# EAGLE design TLNS_driver_board (EAGLE 7.3.0)
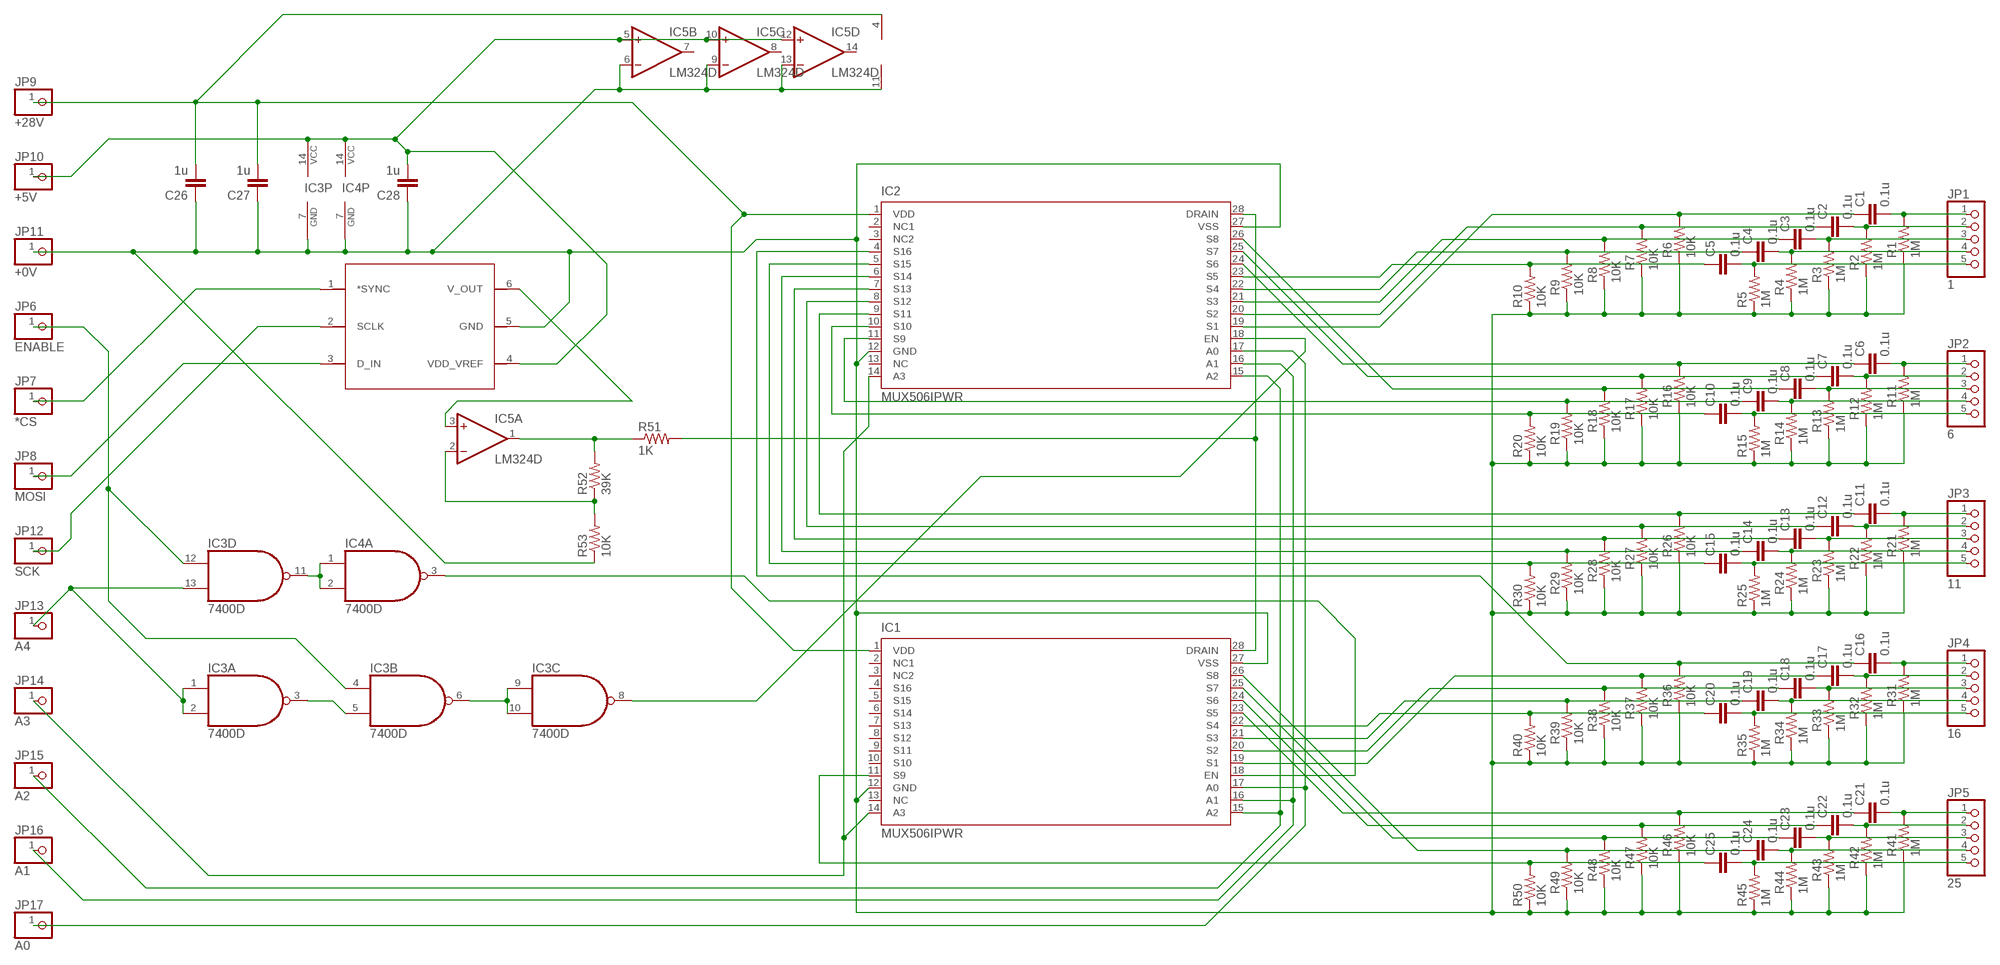
[diagram p0: schematic, sheet 1]

## Parts
C1  0.1u  C-EUC0603K  [C0603K]
C2  0.1u  C-EUC0603K  [C0603K]
C3  0.1u  C-EUC0603K  [C0603K]
C4  0.1u  C-EUC0603K  [C0603K]
C5  0.1u  C-EUC0603K  [C0603K]
C6  0.1u  C-EUC0603K  [C0603K]
C7  0.1u  C-EUC0603K  [C0603K]
C8  0.1u  C-EUC0603K  [C0603K]
C9  0.1u  C-EUC0603K  [C0603K]
C10  0.1u  C-EUC0603K  [C0603K]
C11  0.1u  C-EUC0603K  [C0603K]
C12  0.1u  C-EUC0603K  [C0603K]
C13  0.1u  C-EUC0603K  [C0603K]
C14  0.1u  C-EUC0603K  [C0603K]
C15  0.1u  C-EUC0603K  [C0603K]
C16  0.1u  C-EUC0603K  [C0603K]
C17  0.1u  C-EUC0603K  [C0603K]
C18  0.1u  C-EUC0603K  [C0603K]
C19  0.1u  C-EUC0603K  [C0603K]
C20  0.1u  C-EUC0603K  [C0603K]
C21  0.1u  C-EUC0603K  [C0603K]
C22  0.1u  C-EUC0603K  [C0603K]
C23  0.1u  C-EUC0603K  [C0603K]
C24  0.1u  C-EUC0603K  [C0603K]
C25  0.1u  C-EUC0603K  [C0603K]
C26  1u  C-EUC0603K  [C0603K]
C27  1u  C-EUC0603K  [C0603K]
C28  1u  C-EUC0603K  [C0603K]
IC1  MUX506IPWR  MUX506IPWR550W  [SO28W]
IC2  MUX506IPWR  MUX506IPWR550W  [SO28W]
IC3  7400D  [SO14]
IC4  7400D  [SO14]
IC5  LM324D  [SO14]
JP1  1  PINHD-1X5  [1X05]
JP2  6  PINHD-1X5  [1X05]
JP3  11  PINHD-1X5  [1X05]
JP4  16  PINHD-1X5  [1X05]
JP5  25  PINHD-1X5  [1X05]
JP6  ENABLE  PINHD-1X1  [1X01]
JP7  *CS  PINHD-1X1  [1X01]
JP8  MOSI  PINHD-1X1  [1X01]
JP9  +28V  PINHD-1X1  [1X01]
JP10  +5V  PINHD-1X1  [1X01]
JP11  +0V  PINHD-1X1  [1X01]
JP12  SCK  PINHD-1X1  [1X01]
JP13  A4  PINHD-1X1  [1X01]
JP14  A3  PINHD-1X1  [1X01]
JP15  A2  PINHD-1X1  [1X01]
JP16  A1  PINHD-1X1  [1X01]
JP17  A0  PINHD-1X1  [1X01]
R1  1M  R-US_R0603  [R0603]
R2  1M  R-US_R0603  [R0603]
R3  1M  R-US_R0603  [R0603]
R4  1M  R-US_R0603  [R0603]
R5  1M  R-US_R0603  [R0603]
R6  10K  R-US_R0603  [R0603]
R7  10K  R-US_R0603  [R0603]
R8  10K  R-US_R0603  [R0603]
R9  10K  R-US_R0603  [R0603]
R10  10K  R-US_R0603  [R0603]
R11  1M  R-US_R0603  [R0603]
R12  1M  R-US_R0603  [R0603]
R13  1M  R-US_R0603  [R0603]
R14  1M  R-US_R0603  [R0603]
R15  1M  R-US_R0603  [R0603]
R16  10K  R-US_R0603  [R0603]
R17  10K  R-US_R0603  [R0603]
R18  10K  R-US_R0603  [R0603]
R19  10K  R-US_R0603  [R0603]
R20  10K  R-US_R0603  [R0603]
R21  1M  R-US_R0603  [R0603]
R22  1M  R-US_R0603  [R0603]
R23  1M  R-US_R0603  [R0603]
R24  1M  R-US_R0603  [R0603]
R25  1M  R-US_R0603  [R0603]
R26  10K  R-US_R0603  [R0603]
R27  10K  R-US_R0603  [R0603]
R28  10K  R-US_R0603  [R0603]
R29  10K  R-US_R0603  [R0603]
R30  10K  R-US_R0603  [R0603]
R31  1M  R-US_R0603  [R0603]
R32  1M  R-US_R0603  [R0603]
R33  1M  R-US_R0603  [R0603]
R34  1M  R-US_R0603  [R0603]
R35  1M  R-US_R0603  [R0603]
R36  10K  R-US_R0603  [R0603]
R37  10K  R-US_R0603  [R0603]
R38  10K  R-US_R0603  [R0603]
R39  10K  R-US_R0603  [R0603]
R40  10K  R-US_R0603  [R0603]
R41  1M  R-US_R0603  [R0603]
R42  1M  R-US_R0603  [R0603]
R43  1M  R-US_R0603  [R0603]
R44  1M  R-US_R0603  [R0603]
R45  1M  R-US_R0603  [R0603]
R46  10K  R-US_R0603  [R0603]
R47  10K  R-US_R0603  [R0603]
R48  10K  R-US_R0603  [R0603]
R49  10K  R-US_R0603  [R0603]
R50  10K  R-US_R0603  [R0603]
R51  1K  R-US_R1206  [R1206]
R52  39K  R-US_R0603  [R0603]
R53  10K  R-US_R0603  [R0603]
U$1  DAC7311  [SC70-6]

## Nets
N$1: C1.2 JP1.1 R1.2
N$2: C2.2 JP1.2 R2.2
N$3: C3.2 JP1.3 R3.2
N$4: C4.2 JP1.4 R4.2
N$5: C5.2 JP1.5 R5.2
N$6: C26.1 C27.1 C28.1 IC1.12(GND) IC1.27(VSS) IC2.12(GND) IC2.27(VSS) IC3.7(P:GND) IC4.7(P:GND) IC5.6(B:-IN) IC5.9(C:-IN) IC5.11(P:V-) IC5.13(D:-IN) JP11.1 R1.1 R2.1 R3.1 R4.1 R5.1 R6.1 R7.1 R8.1 R9.1 R10.1 R11.1 R12.1 R13.1 R14.1 R15.1 R16.1 R17.1 R18.1 R19.1 R20.1 R21.1 R22.1 R23.1 R24.1 R25.1 R26.1 R27.1 R28.1 R29.1 R30.1 R31.1 R32.1 R33.1 R34.1 R35.1 R36.1 R37.1 R38.1 R39.1 R40.1 R41.1 R42.1 R43.1 R44.1 R45.1 R46.1 R47.1 R48.1 R49.1 R50.1 R53.1 U$1.5(GND)
N$7: C4.1 IC2.22(S4) R9.2
N$8: C3.1 IC2.21(S3) R8.2
N$9: C2.1 IC2.20(S2) R7.2
N$10: C1.1 IC2.19(S1) R6.2
N$11: C5.1 IC2.23(S5) R10.2
N$12: C6.2 JP2.1 R11.2
N$13: C7.2 JP2.2 R12.2
N$14: C8.2 JP2.3 R13.2
N$15: C9.2 JP2.4 R14.2
N$16: C10.2 JP2.5 R15.2
N$17: C9.1 IC2.11(S9) R19.2
N$18: C8.1 IC2.26(S8) R18.2
N$19: C7.1 IC2.25(S7) R17.2
N$20: C6.1 IC2.24(S6) R16.2
N$21: IC1.28(DRAIN) IC2.28(DRAIN) R51.2
N$22: C10.1 IC2.10(S10) R20.2
N$23: C11.2 JP3.1 R21.2
N$24: C12.2 JP3.2 R22.2
N$25: C13.2 JP3.3 R23.2
N$26: C14.2 JP3.4 R24.2
N$27: C15.2 JP3.5 R25.2
N$28: C14.1 IC2.6(S14) R29.2
N$29: C13.1 IC2.7(S13) R28.2
N$30: C12.1 IC2.8(S12) R27.2
N$31: C11.1 IC2.9(S11) R26.2
N$32: IC3.11(D:O) IC4.1(A:I0) IC4.2(A:I1)
N$33: C15.1 IC2.5(S15) R30.2
N$34: C16.2 JP4.1 R31.2
N$35: C17.2 JP4.2 R32.2
N$36: C18.2 JP4.3 R33.2
N$37: C19.2 JP4.4 R34.2
N$38: C20.2 JP4.5 R35.2
N$39: C19.1 IC1.21(S3) R39.2
N$40: C18.1 IC1.20(S2) R38.2
N$41: C17.1 IC1.19(S1) R37.2
N$42: C16.1 IC2.4(S16) R36.2
N$43: IC1.18(EN) IC4.3(A:O)
N$44: C20.1 IC1.22(S4) R40.2
N$45: C21.2 JP5.1 R41.2
N$46: C22.2 JP5.2 R42.2
N$47: C23.2 JP5.3 R43.2
N$48: C24.2 JP5.4 R44.2
N$49: C25.2 JP5.5 R45.2
N$50: C24.1 IC1.26(S8) R49.2
N$51: C23.1 IC1.25(S7) R48.2
N$52: C22.1 IC1.24(S6) R47.2
N$53: C21.1 IC1.23(S5) R46.2
N$54: C26.2 C27.2 IC1.1(VDD) IC2.1(VDD) IC5.4(P:V+) JP9.1
N$55: C25.1 IC1.11(S9) R50.2
N$56: IC1.17(A0) IC2.17(A0) JP17.1
N$57: IC1.16(A1) IC2.16(A1) JP16.1
N$58: IC1.15(A2) IC2.15(A2) JP15.1
N$59: IC1.14(A3) IC2.14(A3) JP14.1
N$60: IC3.1(A:I0) IC3.2(A:I1) IC3.13(D:I1) JP13.1
N$61: IC3.4(B:I0) IC3.12(D:I0) JP6.1
N$62: C28.2 IC3.14(P:VCC) IC4.14(P:VCC) IC5.5(B:+IN) IC5.10(C:+IN) IC5.12(D:+IN) JP10.1 U$1.4(VDD_VREF)
N$63: IC3.3(A:O) IC3.5(B:I1)
N$64: IC3.6(B:O) IC3.9(C:I0) IC3.10(C:I1)
N$65: IC2.18(EN) IC3.8(C:O)
N$66: IC5.1(A:OUT) R51.1 R52.2
N$67: IC5.2(A:-IN) R52.1 R53.2
N$68: JP8.1 U$1.3(D_IN)
N$69: JP12.1 U$1.2(SCLK)
N$72: JP7.1 U$1.1(*SYNC)
N$73: IC5.3(A:+IN) U$1.6(V_OUT)
Unconnected: IC1.2(NC1) IC1.3(NC2) IC1.4(S16) IC1.5(S15) IC1.6(S14) IC1.7(S13) IC1.9(S11) IC1.10(S10) IC1.13(NC) IC2.2(NC1) IC2.3(NC2) IC2.13(NC) IC4.4(B:I0) IC4.5(B:I1) IC4.6(B:O) IC4.8(C:O) IC4.9(C:I0) IC4.10(C:I1) IC4.11(D:O) IC4.12(D:I0) IC4.13(D:I1) IC5.7(B:OUT) IC5.8(C:OUT) IC5.14(D:OUT)

## Power pins joined to a net without a drawn wire
S12: IC1.8(S12)

## Library data of the parts
C1-C28 = rcl:C-EU: CAPACITOR, European symbol
IC1 IC2 = microchip:MUX506IPWR: USB Microcontrollers with nanoWatt Technology High-Performance, Enhanced Flash, 28/40/44-Pin, Source: http://ww1.microchip.com/downloads/en/devicedoc/39632c.pdf; MF: MICROCHIP; MPN: PIC18F2550-I/SO; OC_FARNELL: 9321268; OC_NEWARK: 73K1297
IC3 IC4 = 74xx-us:74*00: Quad 2-input NAND gate
IC5 = linear:LM324: OP AMP
JP1-JP5 = pinhead:PINHD-1X5: PIN HEADER
JP6-JP17 = pinhead:PINHD-1X1: PIN HEADER
R1-R53 = rcl:R-US_: RESISTOR, American symbol
U$1 = precision_tACS:DAC7311: 12-bit DAC7311

## Board
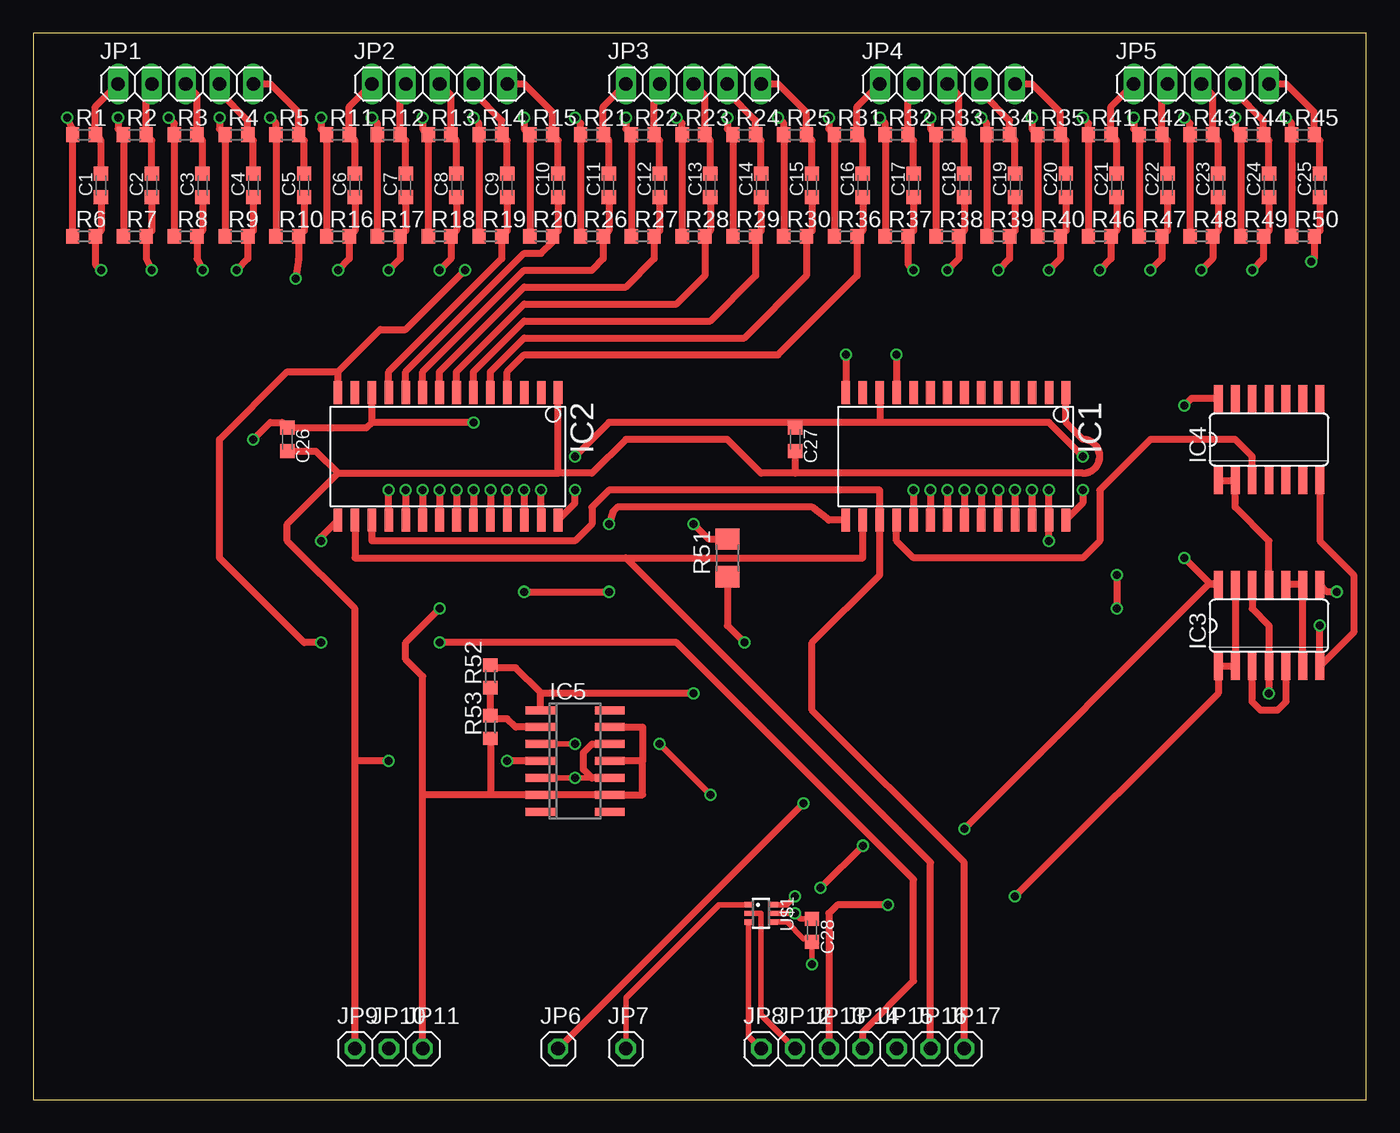
[diagram p1: board, top side]
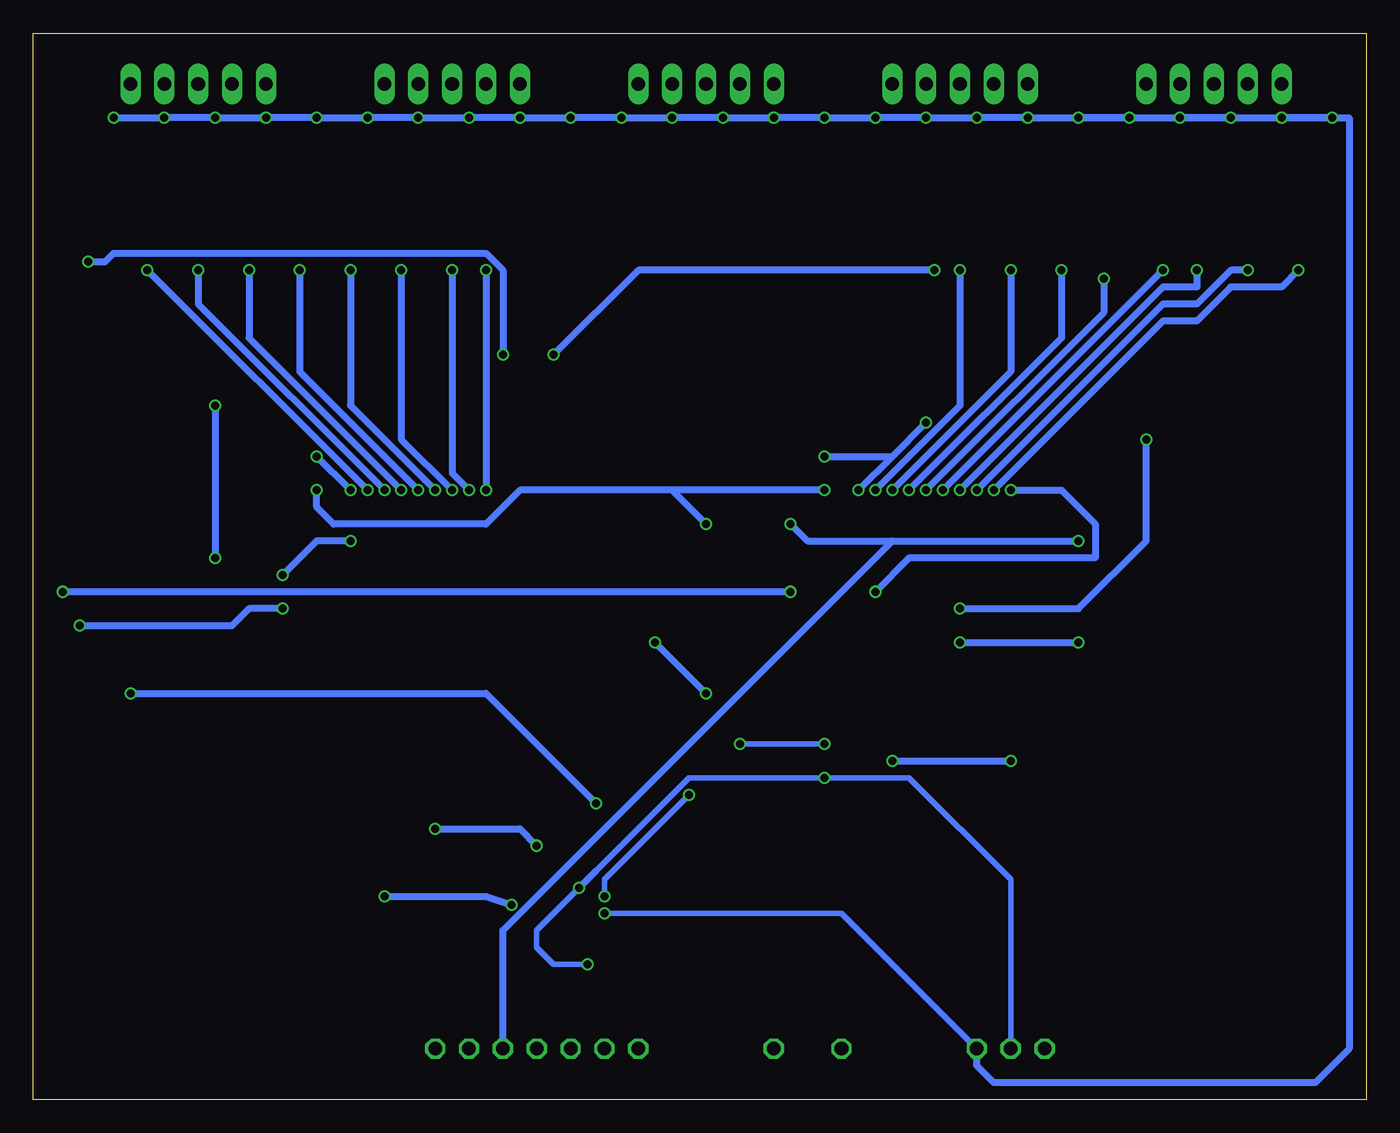
[diagram p2: board, bottom side, seen from below]

Size 100 x 80 mm. Coordinates in mm from the lower left corner, seen from the top.
Outline: 0,0 100,0 100,80 0,80 0,0
Copper layers (1*16): Top 0.035mm / dielectric 1.5mm / Bottom 0.035mm
Design rules "SeeedStudio_2layer_DRU_no_angle_20140221": minimum track width 6mil, minimum drill 12mil, track to track 6mil, track to pad 6mil, pad to pad 6mil, via to via 6mil, smd to smd 0mil, copper to edge 10mil, drill to drill 10mil, minimum pad ring 10mil, minimum via ring 6mil, stop-mask expansion 2mil, vias tented up to drill 100mil, thermal gap 10mil

### Footprints (pad centres in the part's own frame; a part is rotated, then mirrored left to right if it is on the bottom)
C0603K = smd 1.05 x 1.08: 1 -0.875,0; 2 0.875,0
SO28W = smd 0.65 x 1.7: 1 -7.62,-4.78; 2 -6.35,-4.78; 3 -5.08,-4.78; 4 -3.81,-4.78; 5 -2.54,-4.78; 6 -1.27,-4.78; 7 0,-4.78; 8 1.27,-4.78; 9 2.54,-4.78; 10 3.81,-4.78; 11 5.08,-4.78; 12 6.35,-4.78; 13 7.62,-4.78; 14 8.89,-4.78; 15 8.89,4.78; 16 7.62,4.78; 17 6.35,4.78; 18 5.08,4.78; 19 3.81,4.78; 20 2.54,4.78; 21 1.27,4.78; 22 0,4.78; 23 -1.27,4.78; 24 -2.54,4.78; 25 -3.81,4.78; 26 -5.08,4.78; 27 -6.35,4.78; 28 -7.62,4.78
SO14 = smd 0.66 x 2.032: 1 -3.81,-3.073; 2 -2.54,-3.073; 3 -1.27,-3.073; 4 0,-3.073; 5 1.27,-3.073; 6 2.54,-3.073; 7 3.81,-3.073; 8 3.81,3.073; 9 2.54,3.073; 10 1.27,3.073; 11 0,3.073; 12 -1.27,3.073; 13 -2.54,3.073; 14 -3.81,3.073
SO14' = smd 0.6 x 2.2: 1 -3.81,-2.6; 2 -2.54,-2.6; 3 -1.27,-2.6; 4 0,-2.6; 5 1.27,-2.6; 6 2.54,-2.6; 7 3.81,-2.6; 8 3.81,2.6; 9 2.54,2.6; 10 1.27,2.6; 11 0,2.6; 12 -1.27,2.6; 13 -2.54,2.6; 14 -3.81,2.6
1X05 = drill 1.016 long: 1 -5.08,0; 2 -2.54,0; 3 0,0; 4 2.54,0; 5 5.08,0
1X01 = drill 1.016 octagon: 1 0,0
R0603 = smd 1 x 1.1: 1 -0.85,0; 2 0.85,0
R1206 = smd 1.6 x 1.803: 1 -1.422,0; 2 1.422,0
SC70-6 = smd 0.4 x 0.6: 1 -0.65,-0.95; 2 0,-0.95; 3 0.65,-0.95; 4 0.65,0.95; 5 0,0.95; 6 -0.65,0.95

### Placement (x,y rotation side)
C1  5.08,68.58 90 top
C2  8.89,68.58 90 top
C3  12.7,68.58 90 top
C4  16.51,68.58 90 top
C5  20.32,68.58 90 top
C6  24.13,68.58 90 top
C7  27.94,68.58 90 top
C8  31.75,68.58 90 top
C9  35.56,68.58 90 top
C10  39.37,68.58 90 top
C11  43.18,68.58 90 top
C12  46.99,68.58 90 top
C13  50.8,68.58 90 top
C14  54.61,68.58 90 top
C15  58.42,68.58 90 top
C16  62.23,68.58 90 top
C17  66.04,68.58 90 top
C18  69.85,68.58 90 top
C19  73.66,68.58 90 top
C20  77.47,68.58 90 top
C21  81.28,68.58 90 top
C22  85.09,68.58 90 top
C23  88.9,68.58 90 top
C24  92.71,68.58 90 top
C25  96.52,68.58 90 top
C26  19.05,49.53 270 top
C27  57.15,49.53 270 top
C28  58.42,12.7 270 top
IC1  69.85,48.26 180 top
IC2  31.75,48.26 180 top
IC3  92.71,35.56 0 top
IC4  92.71,49.53 0 top
IC5  LM324D  [SO14']  40.64,25.4 270 top
JP1  11.43,76.2 0 top
JP2  30.48,76.2 0 top
JP3  49.53,76.2 0 top
JP4  68.58,76.2 0 top
JP5  87.63,76.2 0 top
JP6  39.37,3.81 0 top
JP7  44.45,3.81 0 top
JP8  54.61,3.81 0 top
JP9  24.13,3.81 0 top
JP10  26.67,3.81 0 top
JP11  29.21,3.81 0 top
JP12  57.15,3.81 0 top
JP13  59.69,3.81 0 top
JP14  62.23,3.81 0 top
JP15  64.77,3.81 0 top
JP16  67.31,3.81 0 top
JP17  69.85,3.81 0 top
R1  3.81,72.39 0 top
R2  7.62,72.39 0 top
R3  11.43,72.39 0 top
R4  15.24,72.39 0 top
R5  19.05,72.39 0 top
R6  3.81,64.77 0 top
R7  7.62,64.77 0 top
R8  11.43,64.77 0 top
R9  15.24,64.77 0 top
R10  19.05,64.77 0 top
R11  22.86,72.39 0 top
R12  26.67,72.39 0 top
R13  30.48,72.39 0 top
R14  34.29,72.39 0 top
R15  38.1,72.39 0 top
R16  22.86,64.77 0 top
R17  26.67,64.77 0 top
R18  30.48,64.77 0 top
R19  34.29,64.77 0 top
R20  38.1,64.77 0 top
R21  41.91,72.39 0 top
R22  45.72,72.39 0 top
R23  49.53,72.39 0 top
R24  53.34,72.39 0 top
R25  57.15,72.39 0 top
R26  41.91,64.77 0 top
R27  45.72,64.77 0 top
R28  49.53,64.77 0 top
R29  53.34,64.77 0 top
R30  57.15,64.77 0 top
R31  60.96,72.39 0 top
R32  64.77,72.39 0 top
R33  68.58,72.39 0 top
R34  72.39,72.39 0 top
R35  76.2,72.39 0 top
R36  60.96,64.77 0 top
R37  64.77,64.77 0 top
R38  68.58,64.77 0 top
R39  72.39,64.77 0 top
R40  76.2,64.77 0 top
R41  80.01,72.39 0 top
R42  83.82,72.39 0 top
R43  87.63,72.39 0 top
R44  91.44,72.39 0 top
R45  95.25,72.39 0 top
R46  80.01,64.77 0 top
R47  83.82,64.77 0 top
R48  87.63,64.77 0 top
R49  91.44,64.77 0 top
R50  95.25,64.77 0 top
R51  52.07,40.64 90 top
R52  34.29,31.75 90 top
R53  34.29,27.94 90 top
U$1  54.61,13.97 270 top

### Tracks (layer width: path | path; a pad name or v marks a point on that pad's centre or on a via)
N$1
  Top 0.508: C1.2 5.08,71.97 R1.2 4.66,74.51 JP1.1
N$2
  Top 0.508: C2.2 8.89,71.97 R2.2 8.47,75.78 JP1.2
N$3
  Top 0.508: C3.2 12.7,71.97 R3.2 12.28,75.35 JP1.3
N$4
  Top 0.508: C4.2 16.51,71.97 R4.2 16.09,73.44 13.97,75.56 JP1.4
N$5
  Top 0.508: C5.2 20.32,71.97 R5.2 19.9,74.08 17.78,76.2 JP1.5
N$6  (via drill 0.6)
  Top 0.406: U$1.5 v57.15,13.97 57.55,13.57 C28.1
  Top 0.508: 25.4,50.8 25,50.41 C26.1 18.66,50.8 17.78,50.8 v16.51,49.53 | 25.4,50.8 IC2.12 | IC2.27 v38.1,45.72 | v33.02,50.8 25.4,50.8 | v76.2,45.72 IC1.27 v76.2,41.91 | v78.74,48.26 76.2,50.8 63.5,50.8 | IC4.7 96.52,41.91 99.06,39.37 99.06,35.03 IC3.7 v96.52,35.56 | JP11.1 29.21,22.86 | 29.21,22.86 29.21,31.75 27.94,33.02 27.94,34.29 v30.48,36.83 | R6.1 R1.1 2.96,72.81 v2.54,73.66 | R7.1 R2.1 6.35,72.81 v6.35,73.66 | R8.1 R3.1 10.58,73.24 v10.16,73.66 | R9.1 R4.1 13.97,72.81 v13.97,73.66 | R10.1 R5.1 18.2,73.24 v17.78,73.66 | R16.1 R11.1 21.59,72.81 v21.59,73.66 | R18.1 R13.1 29.21,72.81 v29.21,73.66 | R19.1 R14.1 33.44,73.24 v33.02,73.66 | R20.1 R15.1 36.83,72.81 v36.83,73.66 | R26.1 R21.1 41.06,73.24 v40.64,73.66 | R27.1 R22.1 44.45,72.81 v44.45,73.66 | R28.1 R23.1 48.68,73.24 v48.26,73.66 | R29.1 R24.1 52.07,72.81 v52.07,73.66 | R30.1 R25.1 56.3,73.24 v55.88,73.66 | R36.1 R31.1 59.69,72.81 v59.69,73.66 | R37.1 R32.1 63.92,73.24 v63.5,73.66 | R38.1 R33.1 67.31,72.81 v67.31,73.66 | R39.1 R34.1 71.54,73.24 v71.12,73.66 | R40.1 R35.1 74.93,72.81 v74.93,73.66 | R46.1 R41.1 79.16,73.24 v78.74,73.66 | R47.1 R42.1 82.55,72.81 v82.55,73.66 | R48.1 R43.1 86.78,73.24 v86.36,73.66 | R49.1 R44.1 90.17,72.81 v90.17,73.66 | R50.1 R45.1 94.4,73.24 v93.98,73.66 | R17.1 R12.1 25.82,73.24 v25.4,73.66 | IC1.12 63.5,50.8 | 63.5,50.8 57.15,50.8 | C27.1 57.15,50.8 | 57.15,50.8 43.18,50.8 v40.64,48.26 | 45.72,25.4 45.72,22.86 IC5.9 IC5.6 34.29,22.86 | 45.72,25.4 IC5.11 | IC5.13 45.72,27.94 45.72,25.4 | 34.29,22.86 29.21,22.86 | R53.1 34.29,22.86 | v81.28,39.37 v81.28,36.83
  Bottom 0.406: v57.15,13.97 39.37,13.97 JP11.1
  Bottom 0.508: v38.1,45.72 35.56,48.26 | 35.56,48.26 v33.02,50.8 | v76.2,45.72 v78.74,48.26 | v96.52,35.56 85.09,35.56 83.82,36.83 v81.28,36.83 | v30.48,36.83 21.59,36.83 16.51,41.91 v16.51,49.53 | v93.98,73.66 v90.17,73.66 v86.36,73.66 v82.55,73.66 v78.74,73.66 v74.93,73.66 v71.12,73.66 v67.31,73.66 v63.5,73.66 v59.69,73.66 v55.88,73.66 v52.07,73.66 v48.26,73.66 v44.45,73.66 v40.64,73.66 v36.83,73.66 v33.02,73.66 v29.21,73.66 v25.4,73.66 | v25.4,73.66 v21.59,73.66 v17.78,73.66 v13.97,73.66 v10.16,73.66 v6.35,73.66 v2.54,73.66 | v25.4,73.66 1.27,73.66 1.27,3.81 3.81,1.27 27.94,1.27 29.21,2.54 JP11.1 | v40.64,48.26 35.56,48.26 | v76.2,41.91 78.74,41.91 v81.28,39.37
N$7  (via drill 0.6)
  Top 0.508: C4.1 16.51,65.19 R9.2 16.09,63.08 v15.24,62.23 | v31.75,45.72 IC2.22
  Bottom 0.508: v15.24,62.23 v31.75,45.72
N$8  (via drill 0.6)
  Top 0.508: C3.1 12.7,65.19 R8.2 12.28,63.08 v12.7,62.23 | v30.48,45.72 IC2.21
  Bottom 0.508: v12.7,62.23 12.7,60.96 15.24,60.96 v30.48,45.72
N$9  (via drill 0.6)
  Top 0.508: C2.1 8.89,65.19 R7.2 8.47,63.08 v8.89,62.23 | v29.21,45.72 IC2.20
  Bottom 0.508: v8.89,62.23 10.16,62.23 12.7,59.69 15.24,59.69 v29.21,45.72
N$10  (via drill 0.6)
  Top 0.508: C1.1 5.08,65.19 R6.2 4.66,62.65 v5.08,62.23 | v27.94,45.72 IC2.19
  Bottom 0.508: v5.08,62.23 6.35,60.96 10.16,60.96 12.7,58.42 15.24,58.42 v27.94,45.72
N$11  (via drill 0.6)
  Top 0.508: C5.1 20.32,65.19 R10.2 19.9,63.08 v19.68,61.59 | v33.02,45.72 IC2.23
  Bottom 0.508: v19.68,61.59 19.68,59.05 v33.02,45.72
N$12
  Top 0.508: JP2.1 23.71,74.51 R11.2 24.13,71.97 C6.2
N$13
  Top 0.508: JP2.2 27.52,75.78 R12.2 27.94,71.97 C7.2
N$14
  Top 0.508: JP2.3 31.33,75.35 R13.2 31.75,71.97 C8.2
N$15
  Top 0.508: JP2.4 33.02,75.56 35.14,73.44 R14.2 35.56,71.97 C9.2
N$16
  Top 0.508: JP2.5 36.83,76.2 38.95,74.08 R15.2 39.37,71.97 C10.2
N$17
  Top 0.508: C9.1 35.56,65.19 R19.2 35.14,63.08 26.67,54.61 IC2.11
N$18  (via drill 0.6)
  Top 0.508: C8.1 31.75,65.19 R18.2 31.33,63.08 v30.48,62.23 | v36.83,45.72 IC2.26
  Bottom 0.508: v30.48,62.23 30.48,52.07 v36.83,45.72
N$19  (via drill 0.6)
  Top 0.508: C7.1 27.94,65.19 R17.2 27.52,63.08 v26.67,62.23 | v35.56,45.72 IC2.25
  Bottom 0.508: v26.67,62.23 26.67,54.61 v35.56,45.72
N$20  (via drill 0.6)
  Top 0.508: C6.1 24.13,65.19 R16.2 23.71,63.08 v22.86,62.23 | v34.29,45.72 IC2.24
  Bottom 0.508: v22.86,62.23 22.86,57.15 v34.29,45.72
N$21  (via drill 0.6)
  Top 0.508: v78.74,45.72 78.74,44.75 IC1.28 | IC2.28 40.64,44.75 v40.64,45.72 | v49.53,43.18 50.65,42.06 R51.2
  Bottom 0.508: 52.07,45.72 63.5,45.72 66.04,43.18 77.47,43.18 78.74,44.45 v78.74,45.72 | v40.64,45.72 52.07,45.72 | 52.07,45.72 v49.53,43.18
N$22
  Top 0.508: C10.1 39.37,65.19 R20.2 38.95,64.35 38.1,63.5 36.83,63.5 27.94,54.61 IC2.10
N$23
  Top 0.508: JP3.1 42.76,74.51 R21.2 43.18,71.97 C11.2
N$24
  Top 0.508: JP3.2 46.57,75.78 R22.2 46.99,71.97 C12.2
N$25
  Top 0.508: JP3.3 50.38,75.35 R23.2 50.8,71.97 C13.2
N$26
  Top 0.508: JP3.4 52.07,75.56 54.19,73.44 R24.2 54.61,71.97 C14.2
N$27
  Top 0.508: JP3.5 55.88,76.2 58,74.08 R25.2 58.42,71.97 C15.2
N$28
  Top 0.508: C14.1 54.61,65.19 R29.2 54.19,61.81 50.8,58.42 36.83,58.42 33.02,54.61 IC2.6
N$29
  Top 0.508: C13.1 50.8,65.19 R28.2 50.38,61.81 48.26,59.69 36.83,59.69 31.75,54.61 IC2.7
N$30
  Top 0.508: C12.1 46.99,65.19 R27.2 46.57,63.08 44.45,60.96 36.83,60.96 30.48,54.61 IC2.8
N$31
  Top 0.508: C11.1 43.18,65.19 R26.2 42.76,63.08 41.91,62.23 36.83,62.23 29.21,54.61 IC2.9
N$32
  Top 0.508: IC4.1 IC4.2 90.17,44.45 92.71,41.91 IC3.11
N$33
  Top 0.508: C15.1 58.42,65.19 R30.2 58,61.81 53.34,57.15 36.83,57.15 34.29,54.61 IC2.5
N$34
  Top 0.508: JP4.1 61.81,74.51 R31.2 62.23,71.97 C16.2
N$35
  Top 0.508: JP4.2 65.62,75.78 R32.2 66.04,71.97 C17.2
N$36
  Top 0.508: JP4.3 69.43,75.35 R33.2 69.85,71.97 C18.2
N$37
  Top 0.508: JP4.4 71.12,75.56 73.24,73.44 R34.2 73.66,71.97 C19.2
N$38
  Top 0.508: JP4.5 74.93,76.2 77.05,74.08 R35.2 77.47,71.97 C20.2
N$39  (via drill 0.6)
  Top 0.508: C19.1 73.66,65.19 R39.2 73.24,63.08 v72.39,62.23 | v68.58,45.72 IC1.21
  Bottom 0.508: v72.39,62.23 72.39,49.53 v68.58,45.72
N$40  (via drill 0.6)
  Top 0.508: C18.1 69.85,65.19 R38.2 69.43,63.08 v68.58,62.23 | v67.31,45.72 IC1.20
  Bottom 0.508: v68.58,62.23 68.58,46.99 v67.31,45.72
N$41  (via drill 0.6)
  Top 0.508: C17.1 66.04,65.19 R37.2 65.62,62.65 v66.04,62.23 | v66.04,45.72 IC1.19
  Bottom 0.508: v66.04,62.23 v66.04,45.72
N$42
  Top 0.508: C16.1 62.23,65.19 R36.2 61.81,61.81 55.88,55.88 36.83,55.88 35.56,54.61 IC2.4
N$43
  Top 0.508: IC4.3 91.44,48.26 90.17,49.53 83.82,49.53 80.01,45.72 80.01,41.91 78.74,40.64 66.04,40.64 64.77,41.91 IC1.18
N$44  (via drill 0.6)
  Top 0.508: C20.1 77.47,65.19 R40.2 77.05,63.08 v76.2,62.23 | v69.85,45.72 IC1.22
  Bottom 0.508: v76.2,62.23 76.2,52.07 v69.85,45.72
N$45
  Top 0.508: JP5.1 80.86,74.51 R41.2 81.28,71.97 C21.2
N$46
  Top 0.508: JP5.2 84.67,75.78 R42.2 85.09,71.97 C22.2
N$47
  Top 0.508: JP5.3 88.48,75.35 R43.2 88.9,71.97 C23.2
N$48
  Top 0.508: JP5.4 90.17,75.56 92.29,73.44 R44.2 92.71,71.97 C24.2
N$49
  Top 0.508: JP5.5 93.98,76.2 96.1,74.08 R45.2 96.52,71.97 C25.2
N$50  (via drill 0.6)
  Top 0.508: C24.1 92.71,65.19 R49.2 92.29,63.08 v91.44,62.23 | v74.93,45.72 IC1.26
  Bottom 0.508: v91.44,62.23 v74.93,45.72
N$51  (via drill 0.6)
  Top 0.508: C23.1 88.9,65.19 R48.2 88.48,63.08 v87.63,62.23 | v73.66,45.72 IC1.25
  Bottom 0.508: v87.63,62.23 87.63,59.69 v73.66,45.72
N$52  (via drill 0.6)
  Top 0.508: C22.1 85.09,65.19 R47.2 84.67,63.08 v83.82,62.23 | v72.39,45.72 IC1.24
  Bottom 0.508: v83.82,62.23 83.82,57.15 v72.39,45.72
N$53  (via drill 0.6)
  Top 0.508: C21.1 81.28,65.19 R46.2 80.86,63.08 v80.01,62.23 | v71.12,45.72 IC1.23
  Bottom 0.508: v80.01,62.23 80.01,54.61 v71.12,45.72
N$54  (via drill 0.6)
  Top 0.508: JP9.1 24.13,25.4 | 24.13,25.4 24.13,36.83 19.05,41.91 19.05,43.18 22.86,46.99 | 22.86,46.99 39.37,46.99 | 39.37,46.99 IC2.1 | 57.15,46.99 78.74,46.99 arc180 78.74,49.53 77.47,50.8 IC1.1 | 57.15,46.99 54.61,46.99 52.07,49.53 44.45,49.53 41.91,46.99 39.37,46.99 | C27.2 57.15,46.99 | C26.2 21.2,48.66 22.86,46.99 | IC5.4 v35.56,25.4 | v26.67,25.4 24.13,25.4
  Bottom 0.508: v35.56,25.4 v26.67,25.4
N$55  (via drill 0.6)
  Top 0.508: C25.1 96.52,65.19 R50.2 96.1,63.08 v95.89,62.87 | v64.77,55.88 IC1.11
  Bottom 0.508: v95.89,62.87 94.61,62.87 93.98,63.5 66.04,63.5 64.77,62.23 v64.77,55.88
N$56
  Top 0.508: IC2.17 25.4,41.91 40.64,41.91 41.91,43.18 41.91,44.45 43.18,45.72 63.5,45.72 IC1.17 63.5,39.37 58.42,34.29 58.42,29.21 69.85,17.78 JP17.1
N$57
  Top 0.508: IC2.16 24.13,40.64 44.45,40.64 | 44.45,40.64 62.23,40.64 IC1.16 | JP16.1 67.31,17.78 44.45,40.64
N$58  (via drill 0.6)
  Top 0.508: IC1.15 59.69,43.48 58.42,44.45 43.81,44.45 43.48,44.12 v43.18,43.18 | v21.59,41.91 21.59,42.21 IC2.15
  Bottom 0.508: v43.18,43.18 41.91,41.91 35.56,41.91 | 35.56,41.91 v21.59,41.91 | JP15.1 64.77,12.7 35.56,41.91
N$59  (via drill 0.6)
  Top 0.508: IC2.14 22.86,54.61 | 22.86,54.61 26.04,57.78 27.94,57.78 v32.38,62.23 | v60.96,55.88 IC1.14 | JP14.1 62.23,5.08 66.04,8.89 66.04,16.51 48.26,34.29 v30.48,34.29 | v21.59,34.29 20.32,34.29 13.97,40.64 13.97,49.53 19.05,54.61 22.86,54.61
  Bottom 0.508: v32.38,62.23 54.61,62.23 v60.96,55.88 | v30.48,34.29 v21.59,34.29
N$60  (via drill 0.6)
  Top 0.508: IC3.13 IC3.2 IC3.1 88.9,30.48 v73.66,15.24 | v64.14,14.61 60.33,14.61 59.69,13.97 JP13.1
  Bottom 0.508: v73.66,15.24 66.04,15.24 v64.14,14.61
N$61  (via drill 0.6)
  Top 0.508: IC3.12 91.44,36.83 92.71,35.56 IC3.4 v92.71,30.48 | v57.78,22.23 JP6.1
  Bottom 0.508: v92.71,30.48 66.04,30.48 v57.78,22.23
N$62  (via drill 0.6)
  Top 0.406: U$1.4 56.53,13.32 57.78,12.06 58.18,12.06 C28.2 v58.42,10.16 | IC5.10 v40.64,24.13 IC5.5
  Top 0.508: IC5.10 41.91,24.13 41.27,24.77 41.27,26.04 41.91,26.67 IC5.12 | IC4.14 86.89,52.6 v86.36,52.07 | v86.36,40.64 88.27,38.73 88.8,38.73 IC3.14 88.16,38.63 v69.85,20.32 | v62.23,19.05 v59.05,15.88
  Bottom 0.406: v58.42,10.16 60.96,10.16 62.23,11.43 62.23,12.7 v59.05,15.88 | 57.78,17.14 50.8,24.13 v40.64,24.13 34.29,24.13 26.67,16.51 JP10.1
  Bottom 0.508: v86.36,52.07 v86.36,40.64 | v69.85,20.32 63.5,20.32 v62.23,19.05 | v59.05,15.88 57.78,17.14
N$63
  Top 0.508: IC3.5 93.98,29.84 93.34,29.21 92.08,29.21 91.44,29.84 IC3.3
N$64
  Top 0.508: IC3.10 IC3.9 IC3.6
N$65  (via drill 0.6)
  Top 0.508: IC2.18 v26.67,45.72 | v36.83,38.1 v43.18,38.1 | v97.79,38.1 97.05,38.1 IC3.8
  Bottom 0.508: v26.67,45.72 22.86,45.72 20.32,43.18 20.32,40.64 34.29,40.64 v36.83,38.1 | v43.18,38.1 v97.79,38.1
N$66  (via drill 0.6)
  Top 0.508: IC5.1 38.04,30.48 | 38.04,30.48 38.04,30.54 36.2,32.38 34.51,32.38 R52.2 | R51.1 52.07,35.56 v53.34,34.29 | v49.53,30.48 38.04,30.48
  Bottom 0.508: v53.34,34.29 v49.53,30.48
N$67
  Top 0.508: R52.1 R53.2 34.51,28.57 35.56,28.57 36.2,27.94 IC5.2
N$68
  Top 0.406: U$1.3 53.66,4.76 JP8.1
N$69
  Top 0.406: U$1.2 54.61,13.97 54.61,6.35 JP12.1
N$72
  Top 0.406: U$1.1 51.45,14.62 44.45,7.62 JP7.1
N$73  (via drill 0.6)
  Top 0.406: U$1.6 56.53,14.62 v57.15,15.24 | v50.8,22.86 v46.99,26.67 | v40.64,26.67 IC5.3
  Bottom 0.406: v57.15,15.24 57.15,16.51 v50.8,22.86 | v46.99,26.67 v40.64,26.67